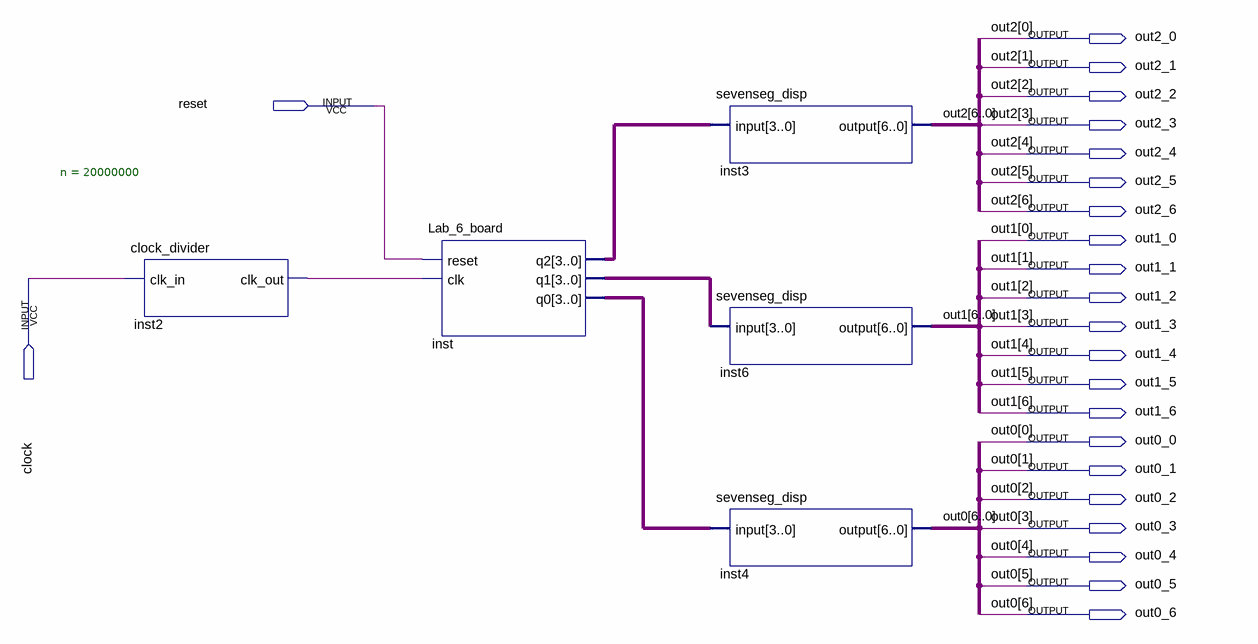
[diagram p0: schematic sheet]
// Quartus schematic Lab_6_board_block.bdf as structural Verilog: 5 symbols, 23 pins
module Lab_6_board_block (
  input  reset,
  input  clock,
  output out2_0,
  output out2_1,
  output out2_2,
  output out2_3,
  output out2_4,
  output out2_5,
  output out2_6,
  output out1_0,
  output out1_1,
  output out1_2,
  output out1_3,
  output out1_4,
  output out1_5,
  output out1_6,
  output out0_0,
  output out0_1,
  output out0_2,
  output out0_3,
  output out0_4,
  output out0_5,
  output out0_6
);

  wire inst2_clk_out;
  wire [3:0] inst_q0, inst_q1, inst_q2;

  clock_divider #(.n(20000000)) inst2 (.clk_in(clock), .clk_out(inst2_clk_out));
  Lab_6_board inst (.reset(reset), .clk(inst2_clk_out), .q2(inst_q2), .q1(inst_q1), .q0(inst_q0));
  sevenseg_disp inst3 (.\input (inst_q2), .\output ({out2_6, out2_5, out2_4, out2_3, out2_2, out2_1, out2_0}));
  sevenseg_disp inst6 (.\input (inst_q1), .\output ({out1_6, out1_5, out1_4, out1_3, out1_2, out1_1, out1_0}));
  sevenseg_disp inst4 (.\input (inst_q0), .\output ({out0_6, out0_5, out0_4, out0_3, out0_2, out0_1, out0_0}));

  // Other names for the same wires on the sheet: out0[6:0] = {out0_6, out0_5, out0_4, out0_3, out0_2, out0_1, out0_0};
  //   out1[6:0] = {out1_6, out1_5, out1_4, out1_3, out1_2, out1_1, out1_0};
  //   out2[6:0] = {out2_6, out2_5, out2_4, out2_3, out2_2, out2_1, out2_0}
endmodule
